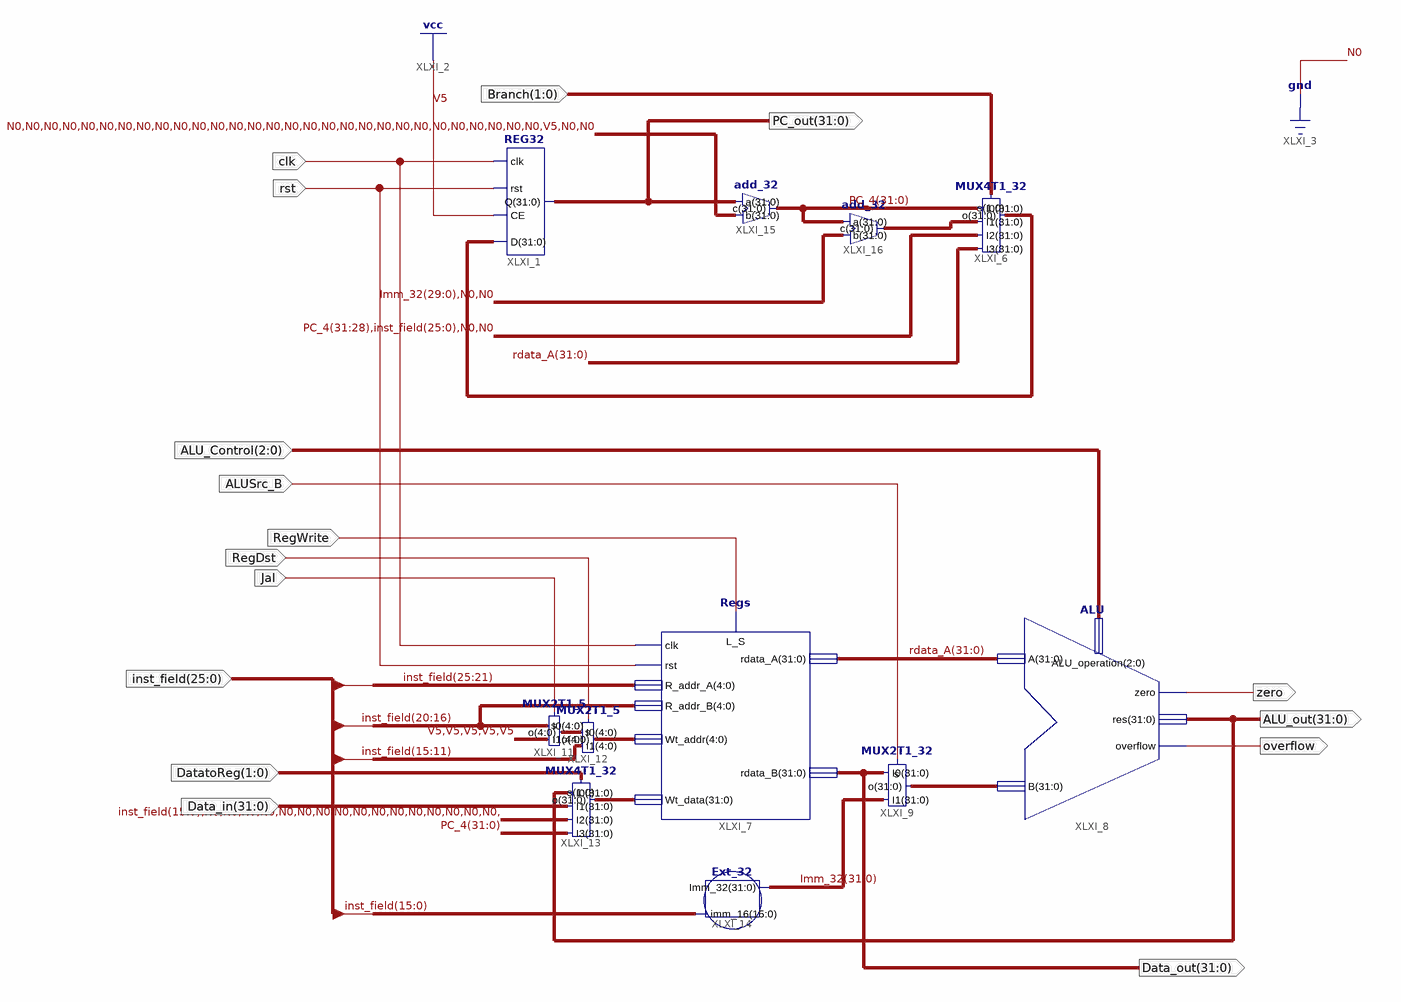
[diagram p0: schematic sheet 1]
// Xilinx ISE schematic Data_path_more.sch (kintex7) as structural Verilog: 11 symbols, 16 ports
module Data_path_more (
  input  RegWrite,
  input  clk,
  input  rst,
  input  [25:0] inst_field,
  input  Jal,
  input  RegDst,
  input  [1:0] DatatoReg,
  input  [2:0] ALU_Control,
  input  ALUSrc_B,
  input  [1:0] Branch,
  input  [31:0] Data_in,
  output [31:0] PC_out,
  output [31:0] Data_out,
  output zero,
  output [31:0] ALU_out,
  output overflow
);

  wire [4:0] XLXN_40, XLXN_42;
  wire [31:0] Imm_32, PC_4, rdata_A, XLXN_8, XLXN_33, XLXN_51, XLXN_52;

  Regs XLXI_7 (
    .clk(clk), .L_S(RegWrite), .rdata_A(rdata_A), .rst(rst), .Wt_data(XLXN_52), .rdata_B(Data_out),
    .R_addr_A(inst_field[25:21]), .R_addr_B(inst_field[20:16]), .Wt_addr(XLXN_42));
  REG32 XLXI_1 (.D(XLXN_51), .CE(1'b1), .rst(rst), .clk(clk), .Q(PC_out));
  add_32 XLXI_15 (.c(PC_4), .a(PC_out), .b(32'b00000000000000000000000000000100));
  MUX4T1_32 XLXI_6 (
    .s(Branch), .I0(PC_4), .I1(XLXN_8), .I2({PC_4[31:28], inst_field, 2'b00}), .I3(rdata_A), .o(XLXN_51));
  add_32 XLXI_16 (.c(XLXN_8), .a(PC_4), .b({Imm_32[29:0], 2'b00}));
  MUX2T1_5 XLXI_12 (.I1(inst_field[15:11]), .I0(XLXN_40), .o(XLXN_42), .s(RegDst));
  MUX2T1_5 XLXI_11 (.I1({5{1'b1}}), .I0(inst_field[20:16]), .o(XLXN_40), .s(Jal));
  MUX4T1_32 XLXI_13 (
    .s(DatatoReg), .I0(ALU_out), .I1(Data_in), .I2({inst_field[15:0], {16{1'b0}}}), .I3(PC_4), .o(XLXN_52));
  Ext_32 XLXI_14 (.imm_16(inst_field[15:0]), .Imm_32(Imm_32));
  MUX2T1_32 XLXI_9 (.s(ALUSrc_B), .I0(Data_out), .I1(Imm_32), .o(XLXN_33));
  ALU XLXI_8 (.zero(zero), .res(ALU_out), .overflow(overflow), .A(rdata_A), .B(XLXN_33), .ALU_operation(ALU_Control));
endmodule
